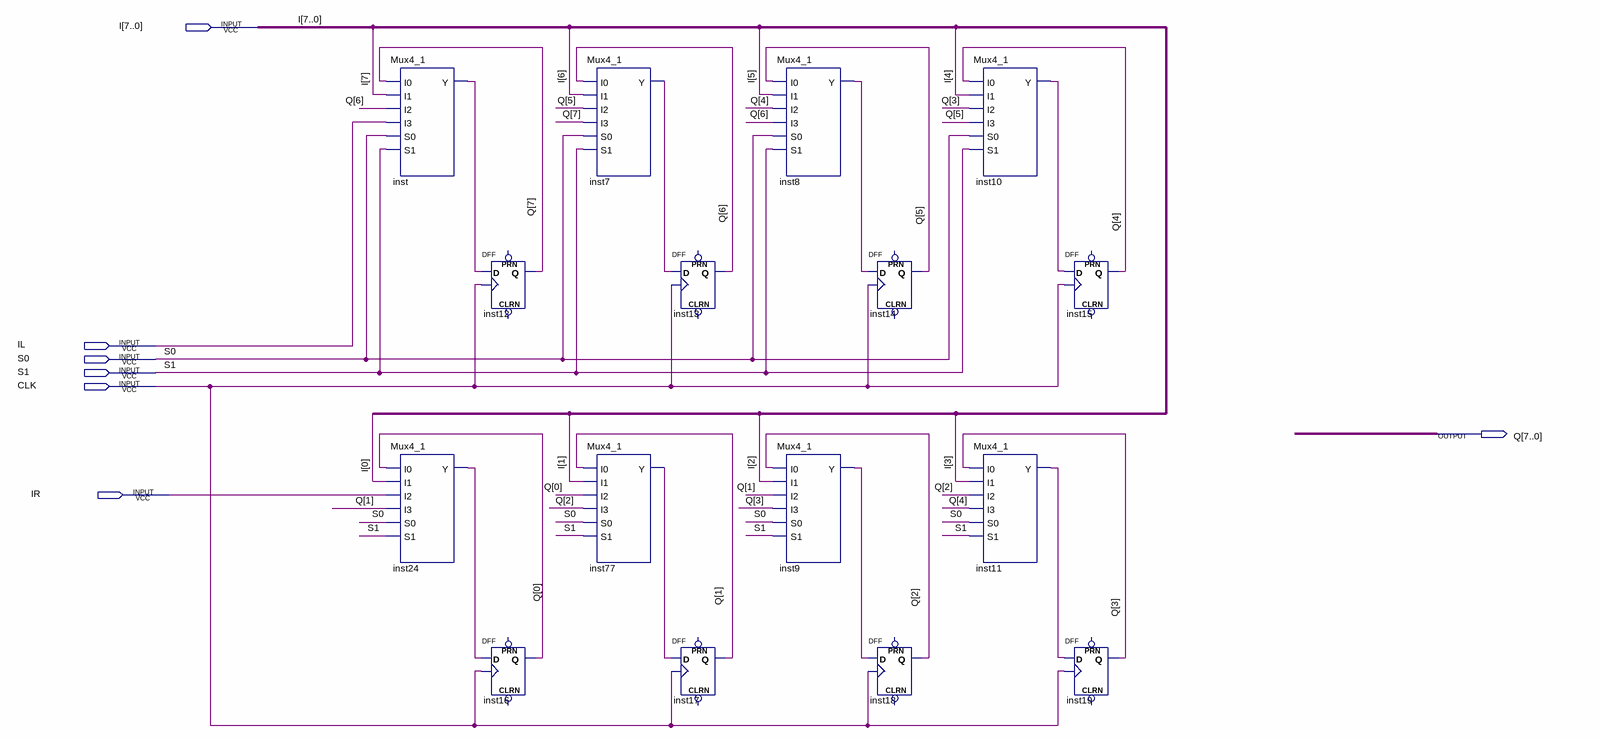
[diagram p0: schematic sheet]
// Quartus schematic SRwPL.bdf as structural Verilog: 16 symbols, 7 pins
module SRwPL (
  input  [7:0] I,
  input  IL,
  input  S0,
  input  S1,
  input  CLK,
  input  IR,
  output [7:0] Q
);

  wire inst7_y, inst8_y, inst9_y, inst10_y, inst11_y, inst24_y, inst77_y, inst_y;

  Mux4_1 inst (.I0(Q[7]), .I1(I[7]), .I2(Q[6]), .I3(IL), .S0(S0), .S1(S1), .Y(inst_y));
  Mux4_1 inst24 (.I0(Q[0]), .I1(I[0]), .I2(IR), .I3(Q[1]), .S0(S0), .S1(S1), .Y(inst24_y));
  DFF inst12 (.CLK(CLK), .D(inst_y), .Q(Q[7]));  // open: CLRN, PRN
  DFF inst16 (.CLK(CLK), .D(inst24_y), .Q(Q[0]));  // open: CLRN, PRN
  Mux4_1 inst7 (.I0(Q[6]), .I1(I[6]), .I2(Q[5]), .I3(Q[7]), .S0(S0), .S1(S1), .Y(inst7_y));
  Mux4_1 inst77 (.I0(Q[1]), .I1(I[1]), .I2(Q[0]), .I3(Q[2]), .S0(S0), .S1(S1), .Y(inst77_y));
  DFF inst13 (.CLK(CLK), .D(inst7_y), .Q(Q[6]));  // open: CLRN, PRN
  DFF inst17 (.CLK(CLK), .D(inst77_y), .Q(Q[1]));  // open: CLRN, PRN
  Mux4_1 inst8 (.I0(Q[5]), .I1(I[5]), .I2(Q[4]), .I3(Q[6]), .S0(S0), .S1(S1), .Y(inst8_y));
  Mux4_1 inst9 (.I0(Q[2]), .I1(I[2]), .I2(Q[1]), .I3(Q[3]), .S0(S0), .S1(S1), .Y(inst9_y));
  DFF inst14 (.CLK(CLK), .D(inst8_y), .Q(Q[5]));  // open: CLRN, PRN
  DFF inst18 (.CLK(CLK), .D(inst9_y), .Q(Q[2]));  // open: CLRN, PRN
  Mux4_1 inst10 (.I0(Q[4]), .I1(I[4]), .I2(Q[3]), .I3(Q[5]), .S0(S0), .S1(S1), .Y(inst10_y));
  Mux4_1 inst11 (.I0(Q[3]), .I1(I[3]), .I2(Q[2]), .I3(Q[4]), .S0(S0), .S1(S1), .Y(inst11_y));
  DFF inst15 (.CLK(CLK), .D(inst10_y), .Q(Q[4]));  // open: CLRN, PRN
  DFF inst19 (.CLK(CLK), .D(inst11_y), .Q(Q[3]));  // open: CLRN, PRN
endmodule
